# Altium schematic sheet CW308T_ATMegaRF_Micro.SchDoc: ATMega2564RFR2 Target
size Letter; Organization: NewAE Technology Inc.; Address1: 1083 Queen St., Suite 196; Address2: Halifax; Address3: NS; Address4: Canada B3H 0B2; SheetApproved: NO
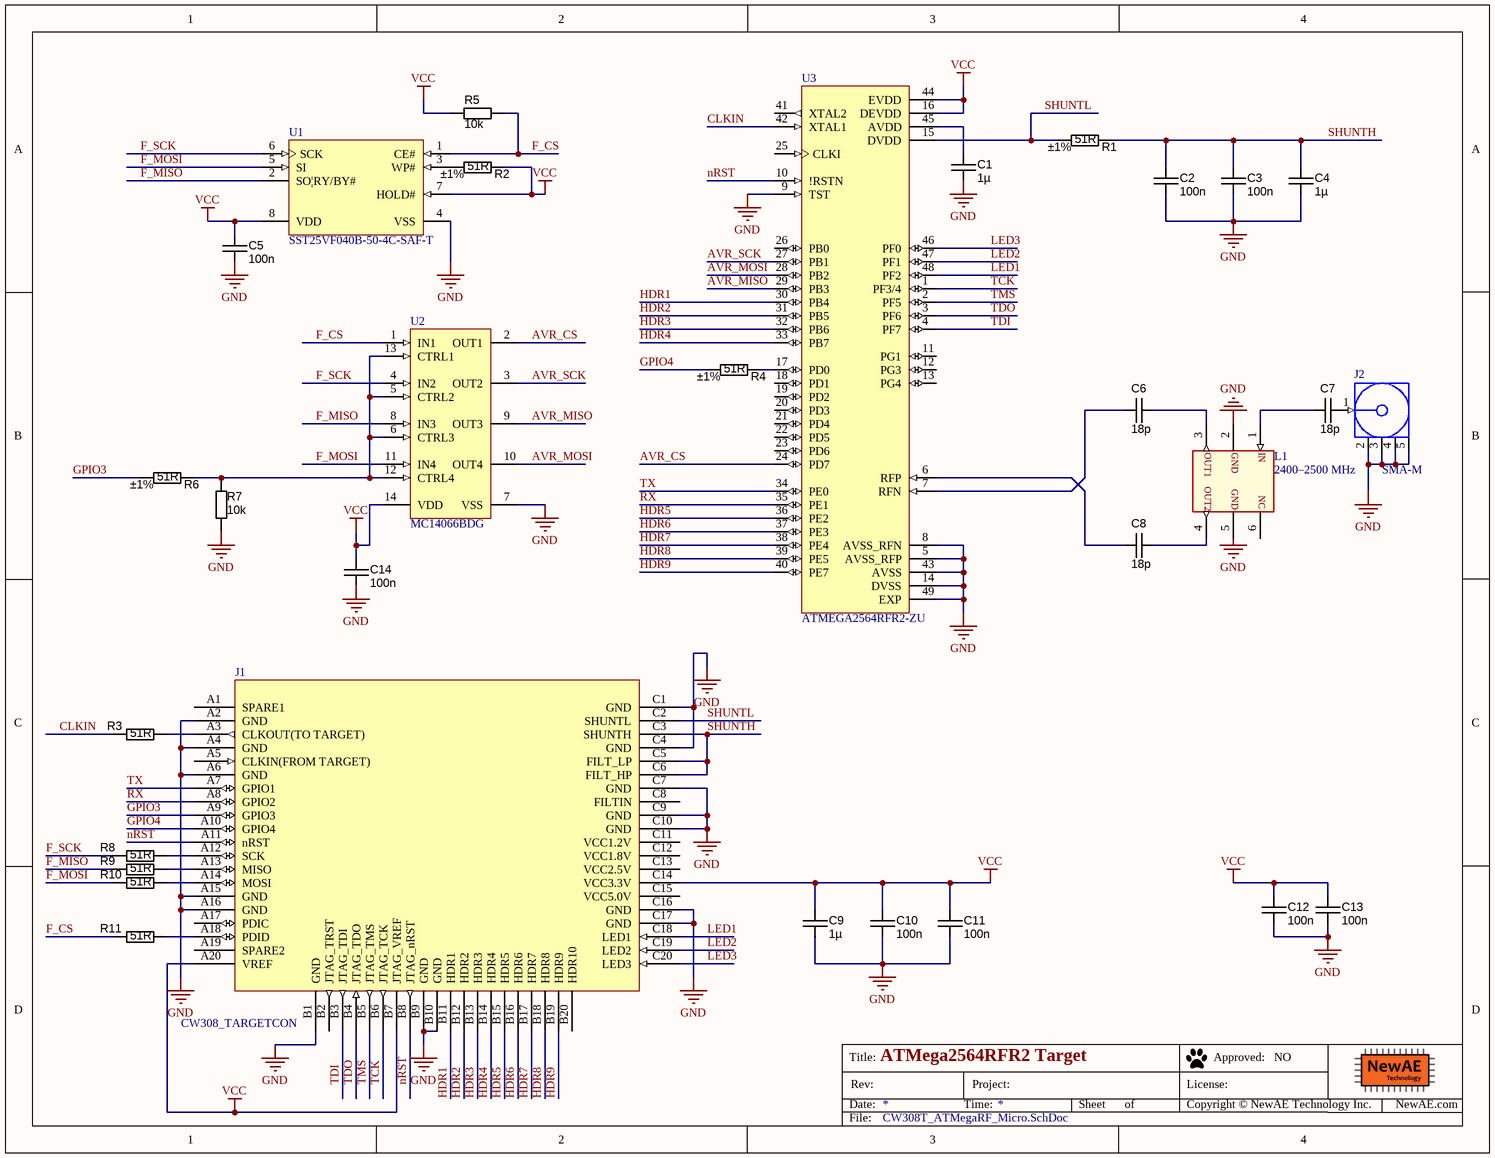
[diagram p0: CW308T_ATMegaRF_Micro.SchDoc]

## Parts
C1  value 1µ  [CAPC1608X90N]  (hidden comment: approved sub OK)
C2  value 100n  [CAPC1608X90N]  (hidden comment: approved sub OK)
C3  value 100n  [CAPC1608X90N]  (hidden comment: approved sub OK)
C4  value 1µ  [CAPC1608X90N]  (hidden comment: approved sub OK)
C5  value 100n  [CAPC1608X90N]  (hidden comment: approved sub OK)
C6  18p  [CAPC1608X90N]
C7  18p  [CAPC1608X90N]
C8  18p  [CAPC1608X90N]
C9  value 1µ  [CAPC1608X90N]  (hidden comment: approved sub OK)
C10  value 100n  [CAPC1608X90N]  (hidden comment: approved sub OK)
C11  value 100n  [CAPC1608X90N]  (hidden comment: approved sub OK)
C12  value 100n  [CAPC1608X90N]  (hidden comment: approved sub OK)
C13  value 100n  [CAPC1608X90N]  (hidden comment: approved sub OK)
C14  value 100n  [CAPC1608X90N]  (hidden comment: approved sub OK)
J1  CW308_TARGETCON  [CW308_TBOARD_CONN]
J2  SMA-M  [CON-SMAM-PCB-EDGE062]
L1  2400–2500 MHz  [WE-BAL_0603]
R1  value 51R  Tolerance: ±1%  [RESC1608X55N]  (hidden comment: Thick Film)
R2  value 51R  Tolerance: ±1%  [RESC1608X55N]  (hidden comment: Thick Film)
R3  value 51R  [RESC1608X55N]  (hidden comment: Thick Film)
R4  value 51R  Tolerance: ±1%  [RESC1608X55N]  (hidden comment: Thick Film)
R5  value 10k  [RESC1608X55N]  (hidden comment: Thick Film)
R6  value 51R  Tolerance: ±1%  [RESC1608X55N]  (hidden comment: Thick Film)
R7  value 10k  [RESC1608X55N]  (hidden comment: Thick Film)
R8  value 51R  [RESC1608X55N]  (hidden comment: Thick Film)
R9  value 51R  [RESC1608X55N]  (hidden comment: Thick Film)
R10  value 51R  [RESC1608X55N]  (hidden comment: Thick Film)
R11  value 51R  [RESC1608X55N]  (hidden comment: Thick Film)
U1  SST25VF040B-50-4C-SAF-T  [MCHP-SOIC-SA8_N]
U2  MC14066BDG  [ONSC-SOIC-14-751A-03_V]
U3  ATMEGA2564RFR2-ZU  [QFN50P700X700X100_HS-49M]

## Nets
GND: C1.2 C2.2 C3.2 C4.2 C5.2 C9.2 C10.2 C11.2 C12.2 C13.2 C14.2 J1.A2(GND) J1.A4(GND) J1.A6(GND) J1.A15(GND) J1.A16(GND) J1.B1(GND) J1.B9(GND) J1.B10(GND) J1.C1(GND) J1.C4(GND) J1.C7(GND) J1.C9(GND) J1.C10(GND) J1.C16(GND) J1.C17(GND) J2.2(GND) J2.3(GND) J2.4(GND) J2.5(GND) L1.2(GND) R7.1 U1.4(VSS) U2.7(VSS) U3.5(AVSS_RFP) U3.8(AVSS_RFN) U3.9(TST) U3.14(DVSS) U3.43(AVSS) U3.49(EXP)
VCC: C5.1 C9.1 C10.1 C11.1 C12.1 C13.1 C14.1 J1.A20(VREF) J1.B7(JTAG_VREF) J1.C14(VCC3.3V) R2.1 R5.1 U1.7(HOLD#) U1.8(VDD) U2.14(VDD) U3.16(DEVDD) U3.44(EVDD)
AVR_CS: U2.2(OUT1) U3.24(PD7)
AVR_MISO: U2.9(OUT3) U3.29(PB3)
AVR_MOSI: U2.10(OUT4) U3.28(PB2)
AVR_SCK: U2.3(OUT2) U3.27(PB1)
CLKIN: R3.2 U3.42(XTAL1)
F_CS: R5.2 R11.2 U1.1(CE#) U2.1(IN1)
F_MISO: R9.2 U1.2(SO|RY/BY#) U2.8(IN3)
F_MOSI: R10.2 U1.5(SI) U2.11(IN4)
F_SCK: R8.2 U1.6(SCK) U2.4(IN2)
GPIO3: J1.A9(GPIO3) R6.2
GPIO4: J1.A10(GPIO4) R4.2
HDR1: J1.B11(HDR1) U3.30(PB4)
HDR2: J1.B12(HDR2) U3.31(PB5)
HDR3: J1.B13(HDR3) U3.32(PB6)
HDR4: J1.B14(HDR4) U3.33(PB7)
HDR5: J1.B15(HDR5) U3.36(PE2)
HDR6: J1.B16(HDR6) U3.37(PE3)
HDR7: J1.B17(HDR7) U3.38(PE4)
HDR8: J1.B18(HDR8) U3.39(PE5)
HDR9: J1.B19(HDR9) U3.40(PE7)
LED1: J1.C18(LED1) U3.48(PF2)
LED2: J1.C19(LED2) U3.47(PF1)
LED3: J1.C20(LED3) U3.46(PF0)
nRST: J1.A11(nRST) J1.B8(JTAG_nRST) U3.10(!RSTN)
RX: J1.A8(GPIO2) U3.35(PE1)
SHUNTH: C2.1 C3.1 C4.1 J1.C3(SHUNTH) J1.C5(FILT_LP) J1.C6(FILT_HP) R1.1
SHUNTL: J1.C2(SHUNTL) R1.2 U3.15(DVDD)
TCK: J1.B6(JTAG_TCK) U3.1(PF3/4)
TDI: J1.B3(JTAG_TDI) U3.4(PF7)
TDO: J1.B4(JTAG_TDO) U3.3(PF6)
TMS: J1.B5(JTAG_TMS) U3.2(PF5)
TX: J1.A7(GPIO1) U3.34(PE0)
NetC1_1: C1.1 U3.45(AVDD)
NetC6_1: C6.1 U3.7(RFN)
NetC6_2: C6.2 L1.3(OUT1)
NetC7_1: C7.1 L1.1(IN)
NetC7_2: C7.2 J2.1(Signal)
NetC8_1: C8.1 U3.6(RFP)
NetC8_2: C8.2 L1.4(OUT2)
NetJ1_A3: J1.A3(CLKOUT(TO_TARGET)) R3.1
NetJ1_A12: J1.A12(SCK) R8.1
NetJ1_A13: J1.A13(MISO) R9.1
NetJ1_A14: J1.A14(MOSI) R10.1
NetJ1_A18: J1.A18(PDID) R11.1
NetR2_2: R2.2 U1.3(WP#)
NetR4_1: R4.1 U3.17(PD0)
NetR6_1: R6.1 R7.2 U2.5(CTRL2) U2.6(CTRL3) U2.12(CTRL4) U2.13(CTRL1)

Not connected (* = marked no-connect by the designer): J1 A1(SPARE1) A5(CLKIN(FROM_TARGET)) A17(PDIC) A19(SPARE2) B2(JTAG_TRST) B20(HDR10) C8(FILTIN) C11(VCC1.2V) C12(VCC1.8V) C13(VCC2.5V) C15(VCC5.0V); L1 5(GND) 6(NC); U3 11(PG1) 12(PG3) 13(PG4) 18(PD1) 19(PD2) 20(PD3) 21(PD4) 22(PD5) 23(PD6) 25(CLKI) 26(PB0) 41(XTAL2)

## Notes on the sheet
- Labels drawn without touching a wire or pin: GND
- Title:
- Date:
- Rev:
- Time:
- Project:
- Sheet
- of
- License:
- Copyright © NewAE Technology Inc.
- Approved:
- NewAE.com
- File:

## Library data of the parts
C1 C4 C9 = CAPC_1u_0603_X7R_16V_10%: Capacitor SMD Cer 1uF 10% 16V X7R 0603; Manufacturer 1: TDK Corporation; Manufacturer Part Number 1: C1608X7R1C105K; Ratings: 16V; X7R; Material: ceramic; SCDType: spec; Package / Case: 0603 (1608 metric); Tolerance: ±10%; Supplier 1: Digi-Key; Supplier Part Number 1: 445-1604-1-ND; ComponentLink1URL: http://product.tdk.com/capacitor/mlcc/en/documents/mlcc_commercial_general_en.pdf; ComponentLink1Description: http://product.tdk.com/capacitor/mlcc/en/documents/mlcc_commercial_general_en.pdf
C2 C3 C5 C10-C14 = CAPC_100n_0603_X7R_50V_10%: Capacitor SMD Cer 100nF 10% 50V X7R 0603; Manufacturer 1: AVX Corporation; Manufacturer Part Number 1: 06035C104KAT2A; Ratings: 50V; X7R; Material: ceramic; SCDType: spec; Manufacturer 2: TDK Corporation; Manufacturer Part Number 2: C1608X7R1H104K; Package / Case: 0603 (1608 Metric); Tolerance: ±10%; Supplier 1: Digi-Key; Supplier Part Number 1: 478-5052-1-ND; ComponentLink1URL: http://www.avx.com/docs/Catalogs/cx7r.pdf; ComponentLink1Description: http://www.avx.com/docs/Catalogs/cx7r.pdf; Supplier 2: Digi-Key; Supplier Part Number 2: 445-1314-1-ND; ComponentLink2URL: http://product.tdk.com/capacitor/mlcc/en/documents/mlcc_commercial_general_en.pdf; ComponentLink2Description: http://product.tdk.com/capacitor/mlcc/en/documents/mlcc_commercial_general_en.pdf
C6-C8 = CAPC_18p_0603_100V: Capacitor SMD Cer 18pF 2% 100V NP0 0603; Manufacturer 1: AVX Corporation; Manufacturer Part Number 1: 06031A180GAT2A; Ratings: 100V; NP0; SCDType: spec; Tolerance: ±2%; Operating Temperature: -55°C ~ 125°C; Package / Case: 0603 (1608 Metric); Supplier 1: Digi-Key; Supplier Part Number 1: 478-6025-1-ND; Size / Dimension: 0.063" L x 0.032" W (1.60mm x 0.81mm); Thickness (Max): 0.035" (0.90mm); ComponentLink1URL: http://www.avx.com/docs/Catalogs/ccog.pdf; ComponentLink1Description: http://www.avx.com/docs/Catalogs/ccog.pdf; Value: 18p
J1 = CW308_TBOARD: CW308 "Standard" Target Board Connector
J2 = CON-SMA-PCBEDGE-003.062: SMA Female Edge Mount Connector for 0.062" Thick Board; PCB_Layout: Pads complies with manufacturer's recommendation.; DatasheetVersion: rev1.0, Aug-2006; PackageVersion: rev1.0, Aug-2006; PackageReference: CON-SMA-EDGE062; PackageDescription: SMA Female Edge Mount Connector for 0.062" Thick Board, 7.9 mm Body Dia.; ComponentLink1Description: Manufacturer URL; ComponentLink1URL: http://www.linxtechnologies.com/; ComponentLink2Description: Datasheet; ComponentLink2URL: http://www.connectorcity.com/diagrams/SMA/CONSMA003.062.pdf
L1 = WE-BAL 0603, 748411245: WE-BAL Multilayer Chip Balun, Frequence=2400–2500 MHz; Manufacturer: Wurth Elektronik; partNo: 748411245; Frequence: 2400–2500 MHz; ComponentLink1Description: Manufacturer; ComponentLink1URL: http://www.we-online.de; Created by: Baojun Chen; Created Date: Nov.2015; ComponentLink2Description: Datasheet; ComponentLink2URL: http://katalog.we-online.de/pbs/datasheet/748411245.pdf
R1-R4 R6 R8-R11 = RES_51R_0603_1%: Resistor SMD chip 51 Ohm 0.1W 1% 0603; Manufacturer 1: Yageo; Manufacturer Part Number 1: RC0603FR-0751RL; Ratings: 1/10 W; SCDType: spec; Package / Case: 0603 (1608 metric); Material: Thick Film; Supplier 1: Digi-Key; Supplier Part Number 1: 311-51.0HRCT-ND
R5 R7 = RES_3K3_0603_5%: Resistor SMD chip 3.3k Ohm 0.1W 5% 0603; Manufacturer 1: Yageo; Manufacturer Part Number 1: RC0603JR-073K3L; Ratings: 1/10 W; SCDType: undef; Package / Case: 0603 (1608 metric); Tolerance: ±5%; Material: thick film; Supplier 1: Digi-Key; Supplier Part Number 1: 311-3.3KGRTR-ND
U1 = CMP-0378-00095-1: 4 Mbit SPI Serial Flash, 2.7 to 3.6 V, 50 MHz, 0 to 70 degC, 8-pin SOIC (SA8), Tape and Reel; Manufacturer: Microchip; DatasheetVersion: Rev. A; ComponentLink1Description: Manufacturer URL; ComponentLink3URL: http://ww1.microchip.com/downloads/en/DeviceDoc/25080A.pdf; ComponentLink2URL: http://ww1.microchip.com/downloads/en/DeviceDoc/25051A.pdf; PackageReference: SOIC-SA8; PackageVersion: Rev. A; ComponentLink1URL: http://www.microchip.com; PartNumber: SST25VF040B-50-4C-SAF-T; PackageDescription: 8-Lead Plastic Small Outline, 4.9 x 3.9 mm Body, 1.27 mm Pitch; ComponentLink2Description: Datasheet; Mounting Technology: Surface Mount; ComponentLink4Description: Product URL; ComponentLink3Description: Package Specification; Code_JEDEC: MS-012; ComponentLink4URL: http://www.microchip.com/SST25VF040B
U2 = CMP-1307-00073-1: Quad Analog Switch / Quad Multiplexer, 3 to 18 V, -55 to 125 degC, 14-Pin SOIC, Pb-Free, Tube; Manufacturer: On Semiconductor; VCC Min (V): 3; Icc Max (uA): 30; VCC Max (V): 18; ComponentLink3URL: http://www.onsemi.com/pub_link/Collateral/751A-03.PDF; Packing: Tube; Mounting Technology: Surface Mount; PartNumber: MC14066BDG; ComponentLink2URL: http://www.onsemi.com/pub_link/Collateral/MC14066B-D.PDF; DatasheetVersion: Rev. 9; ComponentLink1Description: Manufacturer URL; ComponentLink1URL: http://www.onsemi.com/; ComponentLink3Description: Package Specification; RoHS: TRUE; PackageDescription: 14-Pin Small Outline Integrated Circuit, Body 8.65 x 3.9 mm, Pitch 1.27 mm; PackageVersion: Rev. K, 05/2011; PackageReference: SOIC-14-751A-03; ComponentLink2Description: Datasheet
U3 = ATMEGA2565RFR2-ZU: 2.4GHZ 256k SOC 48pin Ind 125C MSL3 - 2.4GHZ 802.15.4 256K SOC 48pin Tray/ VQFN (ZB)